# Altium schematic sheet 11_MIPI_CAM_RX.SchDoc
size 297 x 209 mm
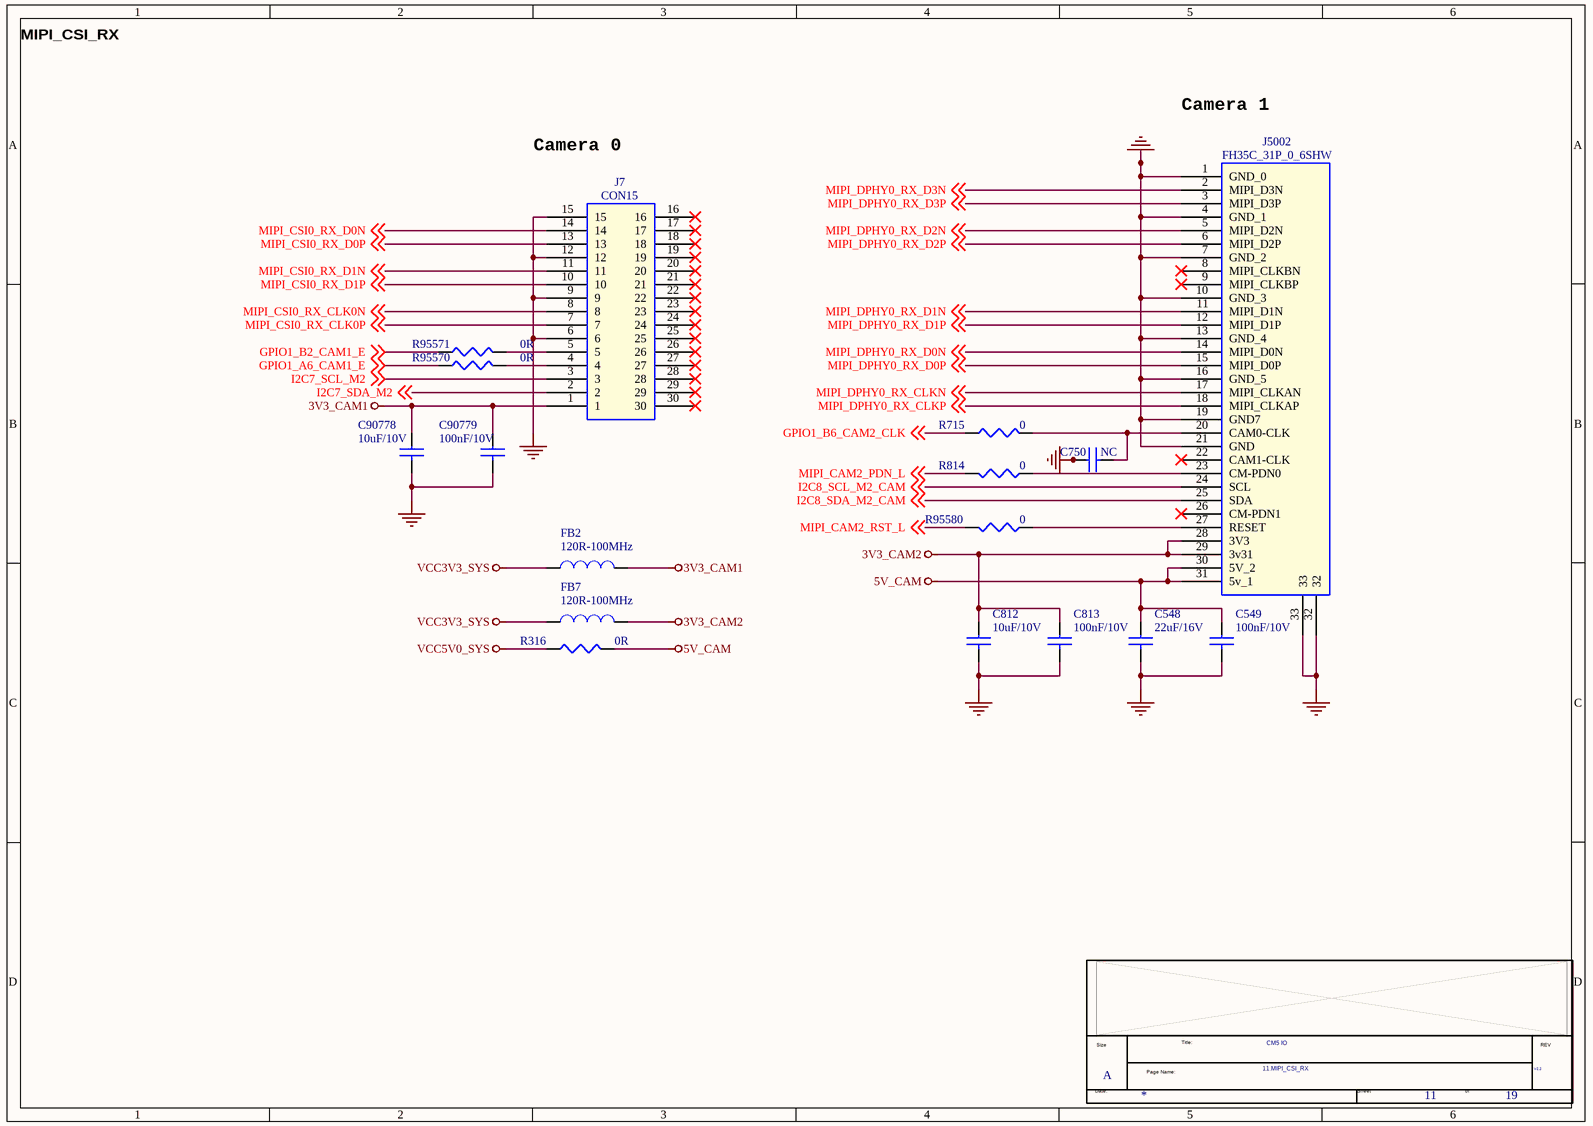
[diagram p0: 11_MIPI_CAM_RX.SchDoc]

## Parts
*  Doc: 11.MIPI_CSI_RX  RevCode: V2.2  Title: CM5 IO  Page Size: A  Page Number: 11  Page Count: 19  (hidden comment: radxa_1010)  (graphical)
C548  22uF/16V  [C0603]
C549  100nF/10V  [C0201]
C750  NC  [C0201]
C812  10uF/10V  [C0603]
C813  100nF/10V  [C0201]
C90778  10uF/10V  [C0603]
C90779  100nF/10V  [C0201]
FB2  120R-100MHz  [L0402]
FB7  120R-100MHz  [L0402]
J7  CON15  [FPC15PIN-1.0MM-LS]
J5002  FH35C_31P_0_6SHW  [FH35C_31P_0_6SHW]
R316  0R  [R0402]
R715  0  [R0603]
R814  0  [R0201]
R95570  0R  [R0402]
R95571  0R  [R0402]
R95580  0  [R0201]

## Nets
3V3_CAM1: C90778.1 C90779.1 FB2.2 J7.1
3V3_CAM2: C812.1 C813.1 FB7.2 J5002.28(3V3) J5002.29(3v31)
5V_CAM: C548.1 C549.1 J5002.30(5V_2) J5002.31(5v_1) R316.2
GND: C548.2 C549.2 C750.1 C812.2 C813.2 C90778.2 C90779.2 J7.6 J7.9 J7.12 J7.15 J5002.1(GND_0) J5002.4(GND_1) J5002.7(GND_2) J5002.10(GND_3) J5002.13(GND_4) J5002.16(GND_5) J5002.19(GND7) J5002.21(GND) J5002.32 J5002.33
VCC3V3_SYS: FB2.1 FB7.1
VCC5V0_SYS: R316.1
GPIO1_A6_CAM1_E: R95570.1 ; off-sheet GPIO1_A6_CAM1_E
GPIO1_B2_CAM1_E: R95571.1 ; off-sheet GPIO1_B2_CAM1_E
GPIO1_B6_CAM2_CLK: R715.1 ; off-sheet GPIO1_B6_CAM2_CLK
I2C7_SCL_M2: J7.3 ; off-sheet I2C7_SCL_M2
I2C7_SDA_M2: J7.2 ; off-sheet I2C7_SDA_M2
I2C8_SCL_M2_CAM: J5002.24(SCL) ; off-sheet I2C8_SCL_M2_CAM
I2C8_SDA_M2_CAM: J5002.25(SDA) ; off-sheet I2C8_SDA_M2_CAM
MIPI_CAM2_PDN_L: R814.1 ; off-sheet MIPI_CAM2_PDN_L
MIPI_CAM2_RST_L: R95580.1 ; off-sheet MIPI_CAM2_RST_L
MIPI_CSI0_RX_CLK0N: J7.8 ; off-sheet MIPI_CSI0_RX_CLK0N
MIPI_CSI0_RX_CLK0P: J7.7 ; off-sheet MIPI_CSI0_RX_CLK0P
MIPI_CSI0_RX_D0N: J7.14 ; off-sheet MIPI_CSI0_RX_D0N
MIPI_CSI0_RX_D0P: J7.13 ; off-sheet MIPI_CSI0_RX_D0P
MIPI_CSI0_RX_D1N: J7.11 ; off-sheet MIPI_CSI0_RX_D1N
MIPI_CSI0_RX_D1P: J7.10 ; off-sheet MIPI_CSI0_RX_D1P
MIPI_DPHY0_RX_CLKN: J5002.17(MIPI_CLKAN) ; off-sheet MIPI_DPHY0_RX_CLKN
MIPI_DPHY0_RX_CLKP: J5002.18(MIPI_CLKAP) ; off-sheet MIPI_DPHY0_RX_CLKP
MIPI_DPHY0_RX_D0N: J5002.14(MIPI_D0N) ; off-sheet MIPI_DPHY0_RX_D0N
MIPI_DPHY0_RX_D0P: J5002.15(MIPI_D0P) ; off-sheet MIPI_DPHY0_RX_D0P
MIPI_DPHY0_RX_D1N: J5002.11(MIPI_D1N) ; off-sheet MIPI_DPHY0_RX_D1N
MIPI_DPHY0_RX_D1P: J5002.12(MIPI_D1P) ; off-sheet MIPI_DPHY0_RX_D1P
MIPI_DPHY0_RX_D2N: J5002.5(MIPI_D2N) ; off-sheet MIPI_DPHY0_RX_D2N
MIPI_DPHY0_RX_D2P: J5002.6(MIPI_D2P) ; off-sheet MIPI_DPHY0_RX_D2P
MIPI_DPHY0_RX_D3N: J5002.2(MIPI_D3N) ; off-sheet MIPI_DPHY0_RX_D3N
MIPI_DPHY0_RX_D3P: J5002.3(MIPI_D3P) ; off-sheet MIPI_DPHY0_RX_D3P
NetC750_2: C750.2 J5002.20(CAM0-CLK) R715.2
NetJ7_4: J7.4 R95570.2
NetJ7_5: J7.5 R95571.2
NetJ5002_23: J5002.23(CM-PDN0) R814.2
NetJ5002_27: J5002.27(RESET) R95580.2

Not connected (* = marked no-connect by the designer): J7 16* 17* 18* 19* 20* 21* 22* 23* 24* 25* 26* 27* 28* 29* 30*; J5002 8(MIPI_CLKBN)* 9(MIPI_CLKBP)* 22(CAM1-CLK)* 26(CM-PDN1)*

## Notes on the sheet
- MIPI_CSI_RX
- Camera 1
- Camera 0
- (in symbol radxa_1010) Size; Title:; REV; Page Name:; Date:; Sheet; of

## Library data of the parts
C548 C812 C90778 = CAP NP_0_Dup2: cap,10.00uF,+/-10%,10V,X5R,C0603; Manufacturer PN: C1608X5R1A106K080AC; Manufacturer: TDK; Tolerance: 10%; Priority: A; Voltage: 10V; PCB Footprint: C0603; Dielectric: X5R; Created by: JJJ; Part Type: C0603; RK PN: C1608X5R1A106K080AC
C549 C813 C90779 = CAP NP_0_Dup2: cap,100.00nF,+/-10%,16V,X5R,C0402; Manufacturer: TDK; RK PN: C1005X5R1C104K050BA; Priority: A; Tolerance: 10%; Voltage: 16V; PCB Footprint: C0201; Dielectric: X5R; Part Type: C0402; Manufacturer PN: C1005X5R1C104K050BA; Created by: JJJ
C750 = C / 100 / nF / 0201_3: 0201 ∮ 10% 100nf X5R 6.3V; FS: Y; Property1: ∮ 10%; FPLIST: C0201,M0201; FunctionGroup: Petrus / BB; Property3: 6.3V; Property2: X5R; PCB Footprint: C0201
FB2 = BEAD_1: BEAD,120R@100MHz,current=2000mA,0603; Manufacturer: Murata; Tolerance: 25%; Irms: 2A; DC Resistor: 0.030ohm; RK PN: BLM18KG121TN1; Priority: L; PCB Footprint: L0402; Part Type: BEAD; Manufacturer PN: BLM18KG121TN1; Created by: DZS
FB7 = BEAD_1: BEAD,120R@100MHz,current=2000mA,0603; Manufacturer PN: BLM18KG121TN1; Manufacturer: Murata; Tolerance: 25%; Irms: 2A; DC Resistor: 0.030ohm; Priority: L; PCB Footprint: L0402; Created by: DZS; Part Type: BEAD; RK PN: BLM18KG121TN1
J7 = CON15_5: PCB Footprint: FPC15PIN-1.0MM-LS
J5002 = DCDC_SY8113_4: Priority: A; PCB Footprint: FH35C_31P_0_6SHW; Created by: JJJ
R316 = RESISTOR_1_Dup1: 通用厚膜电阻,0R,+/-5%,R0805,1/8W.; Manufacturer PN: RC0805JR-070RL; Manufacturer: YAGEO; PCB Footprint: R0603; Tolerance: 5%; Wattage: 1/8W; Priority: A; Created by: YTL; Part Type: 通用厚膜电阻; RK PN: RC0805JR-070RL
R715 = R0402_0: PCB Footprint: R0201
R814 R95580 = R / 0 / ohm / 0201_0: 0201 ∮5% 0ohm 1/20W; Part_Number: R31-0201J0R00F0000; ebom: X / BB / SYS Core; FPLIST: R0201,M0201; Vendor: Walsin; Vendor_PN: WR02X000PAL; FS: Y; FunctionGroup: BB / AP; Property1: ∮5%; Property2: 1/20W; PCB Footprint: R0201
R95570 R95571 = RESISTOR_1_Dup1: 通用厚膜电阻,0R,+/-5%,R0805,1/8W.; Manufacturer PN: RC0805JR-070RL; Manufacturer: YAGEO; Tolerance: 5%; Wattage: 1/8W; Priority: A; PCB Footprint: R0402; Created by: YTL; Part Type: 通用厚膜电阻; RK PN: RC0805JR-070RL
* = radxa_1010: Page Create Date: March  8, 1995; Page Modify Date: *